# Altium project SpliterBoard.PrjPCB
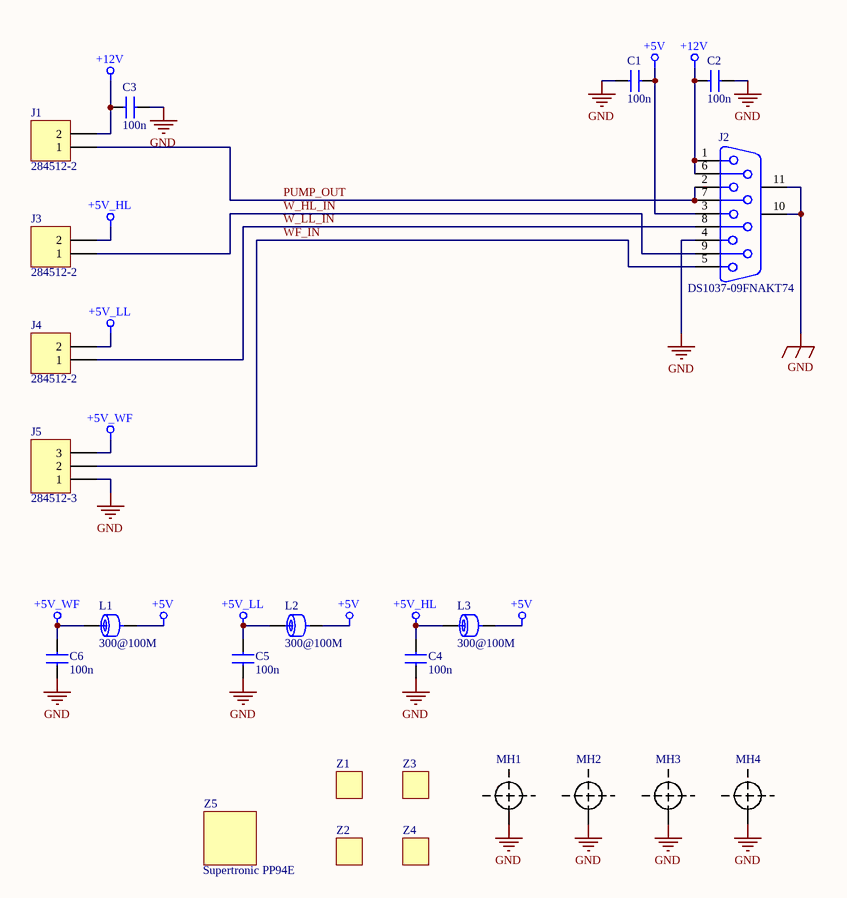
[diagram p0: boxer_spliter.SchDoc]
.revision: 1.0
1 sheet, 23 parts. Net scope: global (net labels, ports and power ports of the same name join across sheets).
Board file: PCB.PcbDoc

## Sheet boxer_spliter.SchDoc: Spliter nawadniania
size A4; DrawnBy: Damian Dolewski; Engineer: Damian Dolewski; DocumentNumber: 1; Revision: 1.0; SheetNumber: 1; SheetTotal: 1

### Parts
C1  value 100n  [C_0805]  (hidden comment: Capacitor)
C2  value 100n  [C_0805]  (hidden comment: Capacitor)
C3  value 100n  [C_0805]  (hidden comment: Capacitor)
C4  value 100n  [C_0805]  (hidden comment: Capacitor)
C5  value 100n  [C_0805]  (hidden comment: Capacitor)
C6  value 100n  [C_0805]  (hidden comment: Capacitor)
J1  284512-2  [284512-2]
J2  DS1037-09FNAKT74  [DB9]
J3  284512-2  [284512-2]
J4  284512-2  [284512-2]
J5  284512-3  [284512-3]
L1  value 300@100M  [L_0805]  (hidden comment: 742792031)
L2  value 300@100M  [L_0805]  (hidden comment: 742792031)
L3  value 300@100M  [L_0805]  (hidden comment: 742792031)
MH1  Mounting hole  [MH_M3]  (value not drawn)
MH2  Mounting hole  [MH_M3]  (value not drawn)
MH3  Mounting hole  [MH_M3]  (value not drawn)
MH4  Mounting hole  [MH_M3]  (value not drawn)
Z1  Hexagonal M3 5mm spacer  [SPACER_M3_5mm]  (value not drawn)
Z2  Hexagonal M3 5mm spacer  [SPACER_M3_5mm]  (value not drawn)
Z3  Hexagonal M3 5mm spacer  [SPACER_M3_5mm]  (value not drawn)
Z4  Hexagonal M3 5mm spacer  [SPACER_M3_5mm]  (value not drawn)
Z5  Supertronic PP94E  [PP94E]

### Nets
+5V: C1.1 J2.3 L1.2 L2.2 L3.2
+5V_HL: C4.1 J3.2 L3.1
+5V_LL: C5.1 J4.2 L2.1
+5V_WF: C6.1 J5.3 L1.1
+12V: C2.1 C3.1 J1.2 J2.1 J2.6
GND: C1.2 C2.2 C3.2 C4.2 C5.2 C6.2 J2.4 J2.10(MH1) J2.11(MH2) J5.1 MH1.MH MH2.MH MH3.MH MH4.MH
PUMP_OUT: J1.1 J2.2 J2.7
W_HL_IN: J2.9 J3.1
W_LL_IN: J2.8 J4.1
WF_IN: J2.5 J5.2

### Notes on the sheet
- Title:
- Size:
- A4
- Number:
- Revision:
- Date:
- File:
- Sheet
- of

### Library data of the parts
J1 J3 J4 = Header 2: Header, 2-Pin; Value: 284512-2
J2 = DB9: Receptacle Assembly, 9 Position, Right Angle; Value: DS1037-09FNAKT74
J5 = Header 3: Header, 3-Pin; Value: 284512-3
L1-L3 = FB: Ferrite Bead
MH1-MH4 = Mounting hole: Mounting hole 2.3mm
Z1-Z4 = SPACER_M3_5mm
Z5 = PP94E: Value: Supertronic PP94E